# Altium schematic sheet Project_Information.SchDoc: =project_title
size Tabloid; CompanyName: Luxonis Holding; Organization: Luxonis Holding; Address1: 1925 Harmony Park Drive; Address2: Westminster, CO; Address3: 80234; Address4: United States; SheetNumber: 1; SheetTotal: 5
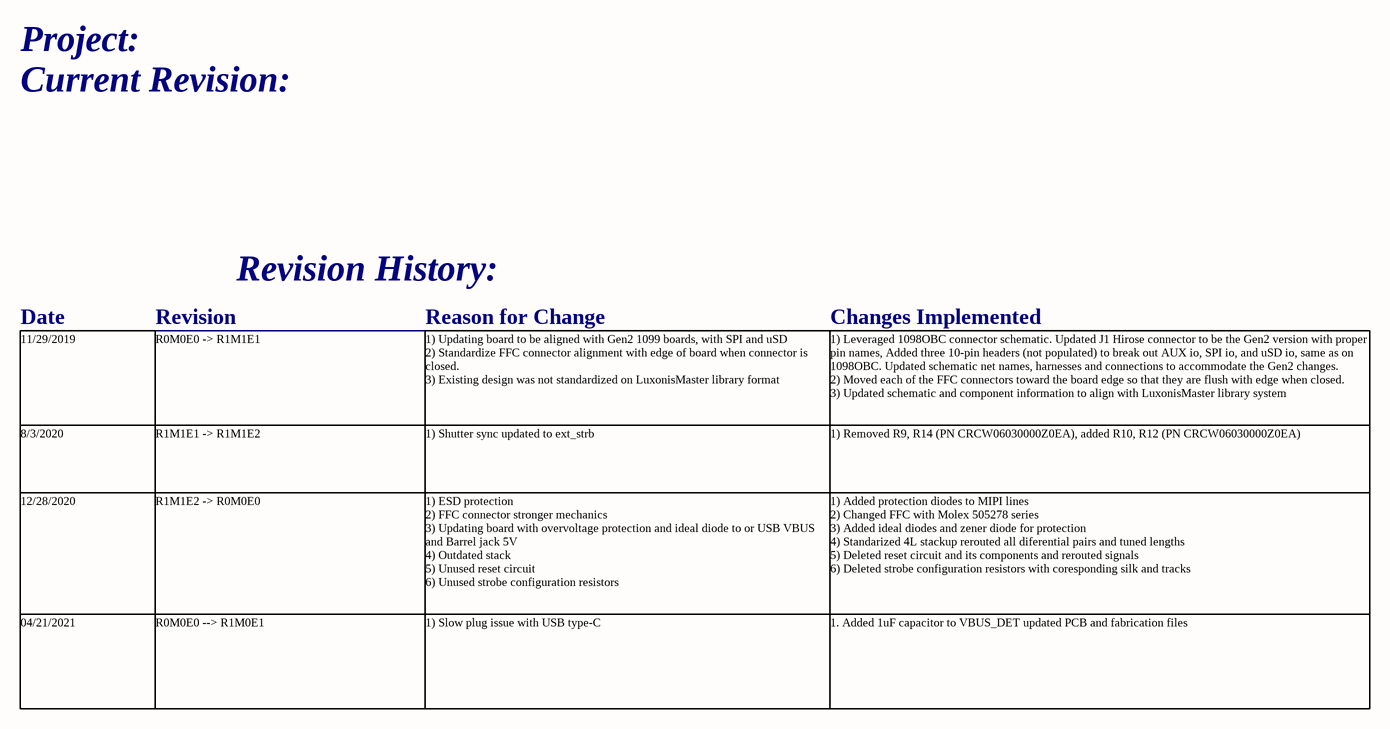
[diagram p0: Project_Information.SchDoc]

## Notes on the sheet
- Project:
- Current Revision:
- Revision History:
- Date
- Revision
- Reason for Change
- Changes Implemented
- 11/29/2019
- R0M0E0 -> R1M1E1
- 1) Updating board to be aligned with Gen2 1099 boards, with SPI and uSD
  2) Standardize FFC connector alignment with edge of board when connector is closed.
  3) Existing design was not standardized on LuxonisMaster library format
- 1) Leveraged 1098OBC connector schematic. Updated J1 Hirose connector to be the Gen2 version with proper pin names, Added three 10-pin headers (not populated) to break out AUX io, SPI io, and uSD io, same as on 1098OBC. Updated schematic net names, harnesses and connections to accommodate the Gen2 changes.
  2) Moved each of the FFC connectors toward the board edge so that they are flush with edge when closed.
  3) Updated schematic and component information to align with LuxonisMaster library system
- 8/3/2020
- R1M1E1 -> R1M1E2
- 1) Shutter sync updated to ext_strb
- 1) Removed R9, R14 (PN CRCW06030000Z0EA), added R10, R12 (PN CRCW06030000Z0EA)
- 12/28/2020
- R1M1E2 -> R0M0E0
- 1) ESD protection
  2) FFC connector stronger mechanics
  3) Updating board with overvoltage protection and ideal diode to or USB VBUS and Barrel jack 5V
  4) Outdated stack
  5) Unused reset circuit
  6) Unused strobe configuration resistors
- 1) Added protection diodes to MIPI lines
  2) Changed FFC with Molex 505278 series
  3) Added ideal diodes and zener diode for protection
  4) Standarized 4L stackup rerouted all diferential pairs and tuned lengths
  5) Deleted reset circuit and its components and rerouted signals
  6) Deleted strobe configuration resistors with coresponding silk and tracks
- 04/21/2021
- R0M0E0 --> R1M0E1
- 1) Slow plug issue with USB type-C
- 1. Added 1uF capacitor to VBUS_DET updated PCB and fabrication files
- Title
- Size:
- Date:
- Tabloid
- Number:
- Time:
- Revision:
- Sheet
- of
- Drawn by: